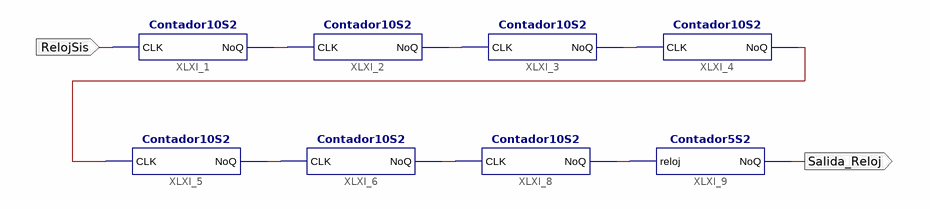
[diagram p0: schematic sheet 1]
// Xilinx ISE schematic Reloj50mHz_a_1Hz.sch (spartan3e) as structural Verilog: 8 symbols, 2 ports
module Reloj50mHz_a_1Hz (
  input  RelojSis,
  output Salida_Reloj
);

  wire XLXN_1, XLXN_2, XLXN_3, XLXN_4, XLXN_5, XLXN_6, XLXN_10;

  Contador10S2 XLXI_1 (.CLK(RelojSis), .NoQ(XLXN_1));
  Contador10S2 XLXI_2 (.CLK(XLXN_1), .NoQ(XLXN_2));
  Contador10S2 XLXI_3 (.CLK(XLXN_2), .NoQ(XLXN_3));
  Contador10S2 XLXI_4 (.CLK(XLXN_3), .NoQ(XLXN_10));
  Contador10S2 XLXI_5 (.CLK(XLXN_10), .NoQ(XLXN_4));
  Contador10S2 XLXI_6 (.CLK(XLXN_4), .NoQ(XLXN_5));
  Contador10S2 XLXI_8 (.CLK(XLXN_5), .NoQ(XLXN_6));
  Contador5S2 XLXI_9 (.NoQ(Salida_Reloj), .reloj(XLXN_6));
endmodule
